# Altium schematic sheet HDMI.SchDoc
size A3; Organization: ICNS, MARCS Institute; Address1: Werrington South Campus, Great Western Highway; Address2: Werrington, NSW, 2747; SheetNumber: 14; SheetTotal: 16
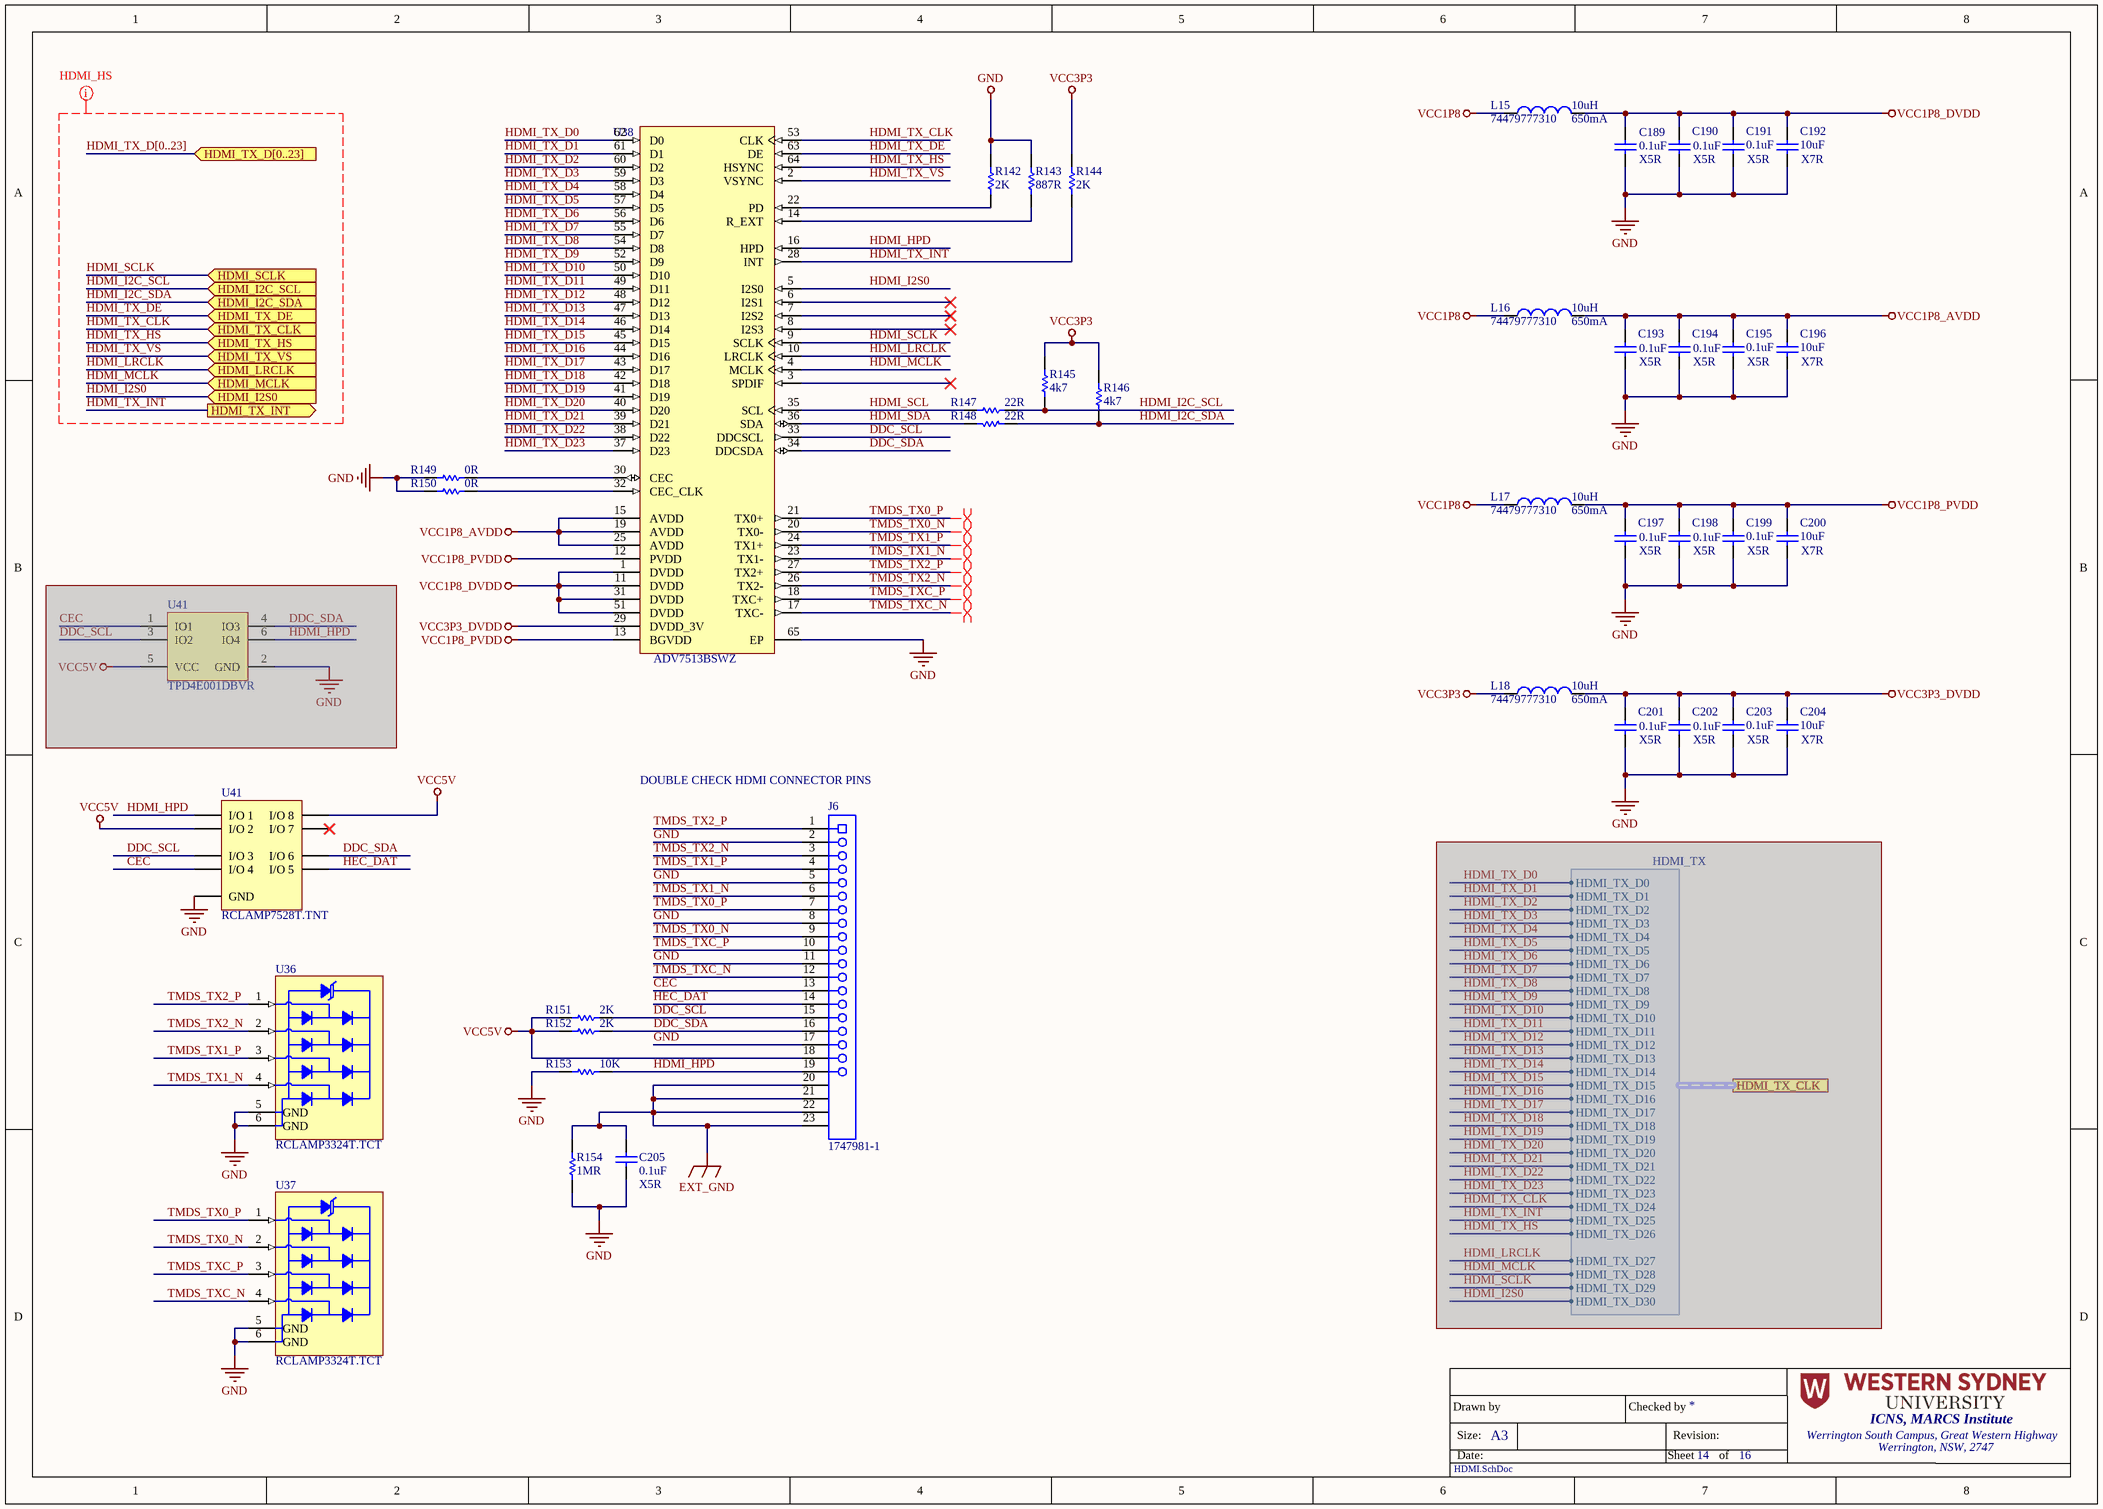
[diagram p0: HDMI.SchDoc]

## Parts
(Parts that share a designator on the sheet are numbered #1, #2 ... from top to bottom, then left to right.)
C189  value 0.1uF  Dielectric: X5R  [CAP 0201 (0603)]  (hidden comment: CL03A104KP3NNNC)
C190  value 0.1uF  Dielectric: X5R  [CAP 0201 (0603)]  (hidden comment: CL03A104KP3NNNC)
C191  value 0.1uF  Dielectric: X5R  [CAP 0201 (0603)]  (hidden comment: CL03A104KP3NNNC)
C192  value 10uF  Dielectric: X7R  [CAP 0805 (2012)]  (hidden comment: GCM21BR71A106KE22K)
C193  value 0.1uF  Dielectric: X5R  [CAP 0201 (0603)]  (hidden comment: CL03A104KP3NNNC)
C194  value 0.1uF  Dielectric: X5R  [CAP 0201 (0603)]  (hidden comment: CL03A104KP3NNNC)
C195  value 0.1uF  Dielectric: X5R  [CAP 0201 (0603)]  (hidden comment: CL03A104KP3NNNC)
C196  value 10uF  Dielectric: X7R  [CAP 0805 (2012)]  (hidden comment: GCM21BR71A106KE22K)
C197  value 0.1uF  Dielectric: X5R  [CAP 0201 (0603)]  (hidden comment: CL03A104KP3NNNC)
C198  value 0.1uF  Dielectric: X5R  [CAP 0201 (0603)]  (hidden comment: CL03A104KP3NNNC)
C199  value 0.1uF  Dielectric: X5R  [CAP 0201 (0603)]  (hidden comment: CL03A104KP3NNNC)
C200  value 10uF  Dielectric: X7R  [CAP 0805 (2012)]  (hidden comment: GCM21BR71A106KE22K)
C201  value 0.1uF  Dielectric: X5R  [CAP 0201 (0603)]  (hidden comment: CL03A104KP3NNNC)
C202  value 0.1uF  Dielectric: X5R  [CAP 0201 (0603)]  (hidden comment: CL03A104KP3NNNC)
C203  value 0.1uF  Dielectric: X5R  [CAP 0201 (0603)]  (hidden comment: CL03A104KP3NNNC)
C204  value 10uF  Dielectric: X7R  [CAP 0805 (2012)]  (hidden comment: GCM21BR71A106KE22K)
C205  value 0.1uF  Dielectric: X5R  [CAP 0201 (0603)]  (hidden comment: CL03A104KP3NNNC)
J6  1747981-1  [TE-1747981-1_V]
L15  74479777310  value 10uH  Current Rating: 650mA  [INDC2012X15N]
L16  74479777310  value 10uH  Current Rating: 650mA  [INDC2012X15N]
L17  74479777310  value 10uH  Current Rating: 650mA  [INDC2012X15N]
L18  74479777310  value 10uH  Current Rating: 650mA  [INDC2012X15N]
R142  value 2K  [RES 0201 (0603)]  (hidden comment: CRCW02012K00FKED)
R143  value 887R  [RES 0402 (1005)]  (hidden comment: RK73H1ETTP8870F)
R144  value 2K  [RES 0201 (0603)]  (hidden comment: CRCW02012K00FKED)
R145  value 4k7  [RES 0201 (0603)]  (hidden comment: AC0201FR-074K7L)
R146  value 4k7  [RES 0201 (0603)]  (hidden comment: AC0201FR-074K7L)
R147  value 22R  [RES 0201 (0603)]  (hidden comment: AC0201FR-0722RL)
R148  value 22R  [RES 0201 (0603)]  (hidden comment: AC0201FR-0722RL)
R149  value 0R  [RES 0201 (0603)]  (hidden comment: AF0201JR-070RL)
R150  value 0R  [RES 0201 (0603)]  (hidden comment: AF0201JR-070RL)
R151  value 2K  [RES 0201 (0603)]  (hidden comment: CRCW02012K00FKED)
R152  value 2K  [RES 0201 (0603)]  (hidden comment: CRCW02012K00FKED)
R153  value 10K  [RES 0201 (0603)]  (hidden comment: AC0201FR-0710KL)
R154  value 1MR  [RES 0201 (0603)]  (hidden comment: ERJ-1GNF1004C)
U36  RCLAMP3324T.TCT  [DIO_RCLAMP3324T.TCT]
U37  RCLAMP3324T.TCT  [DIO_RCLAMP3324T.TCT]
U38  ADV7513BSWZ  [ADI-LQFP-64_L]
U41#1  TPD4E001DBVR  [DBV0006A_L]  (masked out: inside a compile mask, not in the netlist)
U41#2  RCLAMP7528T.TNT  [DIO_RCLAMP7528T.TNT]

## Ports
HDMI_I2C_SCL (in), HDMI_I2C_SDA (in), HDMI_I2S0 (in), HDMI_LRCLK (in), HDMI_MCLK (in), HDMI_SCLK (in), HDMI_TX_CLK (harness HDMI_TX), HDMI_TX_CLK (in), HDMI_TX_D[0..23] (in), HDMI_TX_DE (in), HDMI_TX_HS (in), HDMI_TX_INT (out), HDMI_TX_VS (in)

## Harnesses
HDMI_TX: HDMI_TX_D0, HDMI_TX_D1, HDMI_TX_D2, HDMI_TX_D3, HDMI_TX_D4, HDMI_TX_D5, HDMI_TX_D6, HDMI_TX_D7, HDMI_TX_D8, HDMI_TX_D9, HDMI_TX_D10, HDMI_TX_D11, HDMI_TX_D12, HDMI_TX_D13, HDMI_TX_D14, HDMI_TX_D15, HDMI_TX_D16, HDMI_TX_D17, HDMI_TX_D18, HDMI_TX_D19, HDMI_TX_D20, HDMI_TX_D21, HDMI_TX_D22, HDMI_TX_D23, HDMI_TX_D24, HDMI_TX_D25, HDMI_TX_D26, HDMI_TX_D27, HDMI_TX_D28, HDMI_TX_D29, HDMI_TX_D30

## Nets
EXT_GND: C205.2 J6.20(SHLD1) J6.21(SHLD2) J6.22(SHLD3) J6.23(SHLD4) R154.2
GND: C189.2 C190.2 C191.2 C192.2 C193.2 C194.2 C195.2 C196.2 C197.2 C198.2 C199.2 C200.2 C201.2 C202.2 C203.2 C204.2 C205.1 J6.2 J6.5 J6.8 J6.11 J6.17 R142.1 R143.1 R149.2 R150.2 R153.1 R154.1 U36.5(GND) U36.6(GND) U37.5(GND) U37.6(GND) U38.65(EP) U41#2.3(GND)
VCC1P8: L15.1 L16.1 L17.1
VCC1P8_AVDD: C193.1 C194.1 C195.1 C196.1 L16.2 U38.15(AVDD) U38.19(AVDD) U38.25(AVDD)
VCC1P8_DVDD: C189.1 C190.1 C191.1 C192.1 L15.2 U38.1(DVDD) U38.11(DVDD) U38.31(DVDD) U38.51(DVDD)
VCC1P8_PVDD: C197.1 C198.1 C199.1 C200.1 L17.2 U38.12(PVDD) U38.13(BGVDD)
VCC3P3: L18.1 R144.1 R145.2 R146.2
VCC3P3_DVDD: C201.1 C202.1 C203.1 C204.1 L18.2 U38.29(DVDD_3V)
VCC5V: J6.18 R151.1 R152.1 U41#2.2(I/O_2) U41#2.9(I/O_8)
CEC: J6.13 U41#2.5(I/O_4)
DDC_SCL: J6.15 R151.2 U38.33(DDCSCL) U41#2.4(I/O_3)
DDC_SDA: J6.16 R152.2 U38.34(DDCSDA) U41#2.7(I/O_6)
HDMI_HPD: J6.19 R153.2 U38.16(HPD) U41#2.1(I/O_1)
HDMI_I2C_SCL: R145.1 R147.1 ; port HDMI_I2C_SCL
HDMI_I2C_SDA: R146.1 R148.2 ; port HDMI_I2C_SDA
HDMI_I2S0: U38.5(I2S0) ; port HDMI_I2S0
HDMI_LRCLK: U38.10(LRCLK) ; port HDMI_LRCLK
HDMI_MCLK: U38.4(MCLK) ; port HDMI_MCLK
HDMI_SCL: R147.2 U38.35(SCL)
HDMI_SCLK: U38.9(SCLK) ; port HDMI_SCLK
HDMI_SDA: R148.1 U38.36(SDA)
HDMI_TX_CLK: U38.53(CLK) ; port HDMI_TX_CLK
HDMI_TX_D0: U38.62(D0)
HDMI_TX_D1: U38.61(D1)
HDMI_TX_D2: U38.60(D2)
HDMI_TX_D3: U38.59(D3)
HDMI_TX_D4: U38.58(D4)
HDMI_TX_D5: U38.57(D5)
HDMI_TX_D6: U38.56(D6)
HDMI_TX_D7: U38.55(D7)
HDMI_TX_D8: U38.54(D8)
HDMI_TX_D9: U38.52(D9)
HDMI_TX_D10: U38.50(D10)
HDMI_TX_D11: U38.49(D11)
HDMI_TX_D12: U38.48(D12)
HDMI_TX_D13: U38.47(D13)
HDMI_TX_D14: U38.46(D14)
HDMI_TX_D15: U38.45(D15)
HDMI_TX_D16: U38.44(D16)
HDMI_TX_D17: U38.43(D17)
HDMI_TX_D18: U38.42(D18)
HDMI_TX_D19: U38.41(D19)
HDMI_TX_D20: U38.40(D20)
HDMI_TX_D21: U38.39(D21)
HDMI_TX_D22: U38.38(D22)
HDMI_TX_D23: U38.37(D23)
HDMI_TX_DE: U38.63(DE) ; port HDMI_TX_DE
HDMI_TX_HS: U38.64(HSYNC) ; port HDMI_TX_HS
HDMI_TX_INT: R144.2 U38.28(INT) ; port HDMI_TX_INT
HDMI_TX_VS: U38.2(VSYNC) ; port HDMI_TX_VS
HEC_DAT: J6.14 U41#2.6(I/O_5)
TMDS_TX0_N: J6.9 U37.2(In_2) U38.20(TX0-)
TMDS_TX0_P: J6.7 U37.1(In_1) U38.21(TX0+)
TMDS_TX1_N: J6.6 U36.4(In_4) U38.23(TX1-)
TMDS_TX1_P: J6.4 U36.3(In_3) U38.24(TX1+)
TMDS_TX2_N: J6.3 U36.2(In_2) U38.26(TX2-)
TMDS_TX2_P: J6.1 U36.1(In_1) U38.27(TX2+)
TMDS_TXC_N: J6.12 U37.4(In_4) U38.17(TXC-)
TMDS_TXC_P: J6.10 U37.3(In_3) U38.18(TXC+)
NetR142_2: R142.2 U38.22(PD)
NetR143_2: R143.2 U38.14(R_EXT)
NetR149_1: R149.1 U38.30(CEC)
NetR150_1: R150.1 U38.32(CEC_CLK)

Not connected (* = marked no-connect by the designer): U38 3(SPDIF)* 6(I2S1)* 7(I2S2)* 8(I2S3)*; U41#2 8(I/O_7)*

## Buses and harness runs
bus HDMI_TX_D[0..23] = port HDMI_TX_D[0..23]

## Layout directives
differential pair; differential pair class TMDS_TX0; net class DIGITAL: TMDS_TX0_N, TMDS_TX0_P
differential pair; net class DIGITAL; differential pair class TMDS_TX1: TMDS_TX1_N, TMDS_TX1_P
differential pair; net class DIGITAL; differential pair class TMDS_TX2: TMDS_TX2_N, TMDS_TX2_P
differential pair; net class DIGITAL; differential pair class TMDS_TXC: TMDS_TXC_N, TMDS_TXC_P
net class HDMI: HDMI_I2C_SCL, HDMI_I2C_SDA, HDMI_I2S0, HDMI_LRCLK, HDMI_MCLK, HDMI_SCLK, HDMI_TX_CLK, HDMI_TX_D[0..23], HDMI_TX_DE, HDMI_TX_HS, HDMI_TX_INT, HDMI_TX_VS

## Notes on the sheet
- (near J6) DOUBLE CHECK HDMI CONNECTOR PINS
- Drawn by
- Size:
- Date:
- A3
- Checked by
- Sheet
- Revision:
- of

## Library data of the parts
C189-C191 C193-C195 C197-C199 C201-C203 C205 = CMP-003-000014-1: Cap Ceramic 0.1uF 10V X5R 10% Pad SMD 0201 85C T/R; Manufacturer: Samsung; Capacitance: 100nF; Stock 1: 12175; Pricing 1: 1=0.10000, 10=0.02900, 50=0.01600, 100=0.01300, 500=0.00932, 1000=0.00732, 2500=0.00666, 5000=0.00612 (USD); RoHS: Yes; Mount: Surface Mount; Case/Package: 0201; Case Code (Metric): 0603; Case Code (Imperial): 0201; Contact Plating: Tin; Min Operating Temperature: -55°C; Max Operating Temperature: 85°C; Tolerance: 10%; Packaging: Tape and Reel; Package Quantity: 1; Voltage Rating: 10V; Length: 0.6mm; Height: 0.3mm; Width: 0.012inch; Thickness: 0.013inch; Depth: 0.3mm; Radiation Hardening: No; ComponentLink1URL: https://datasheet.ciiva.com/25803/cl03a104kp3nnnc-25803204.pdf?src-supplier=Digi-Key; ComponentLink1Description: https://datasheet.ciiva.com/25803/cl03a104kp3nnnc-25803204.pdf?src-supplier=Digi-Key; ComponentLink2URL: https://datasheet.ciiva.com/26838/getdatasheetpartid-357484-26838083.pdf?src-supplier=Verical; ComponentLink2Description: https://datasheet.ciiva.com/26838/getdatasheetpartid-357484-26838083.pdf?src-supplier=Verical; Source: ICNS_PropheseeLib.SchLib; Manufacturer Part Number: CL03A104KP3NNNC; Lead Free: Lead Free; Series: CL; Design Item ID: CL03A104KP3NNNC; Voltage Rating (DC): 10V; Category: Ceramic Capacitors; Construction: Flat
C192 C196 C200 C204 = CMP-003-000011-1: 0805 10 uF 10 V ±10 % Tolerance X7R Surface Mount Multilayer Ceramic Capacitor; Manufacturer: Murata; Tolerance: 10%; Voltage Rating: 10V; RoHS: Yes; Mount: Surface Mount; Case/Package: 0805; Case Code (Metric): 2012; Case Code (Imperial): 0805; Min Operating Temperature: -55°C; Max Operating Temperature: 125°C; Packaging: Tape and Reel; Package Quantity: 10000; Capacitance: 10uF; Length: 0.079inch; Height: 1.25mm; Width: 1.25mm; Thickness: 0.055inch; ComponentLink1URL: http://www.mouser.com/ds/2/281/c03e-806517.pdf?src-supplier=Mouser; ComponentLink1Description: http://www.mouser.com/ds/2/281/c03e-806517.pdf?src-supplier=Mouser; ComponentLink2URL: https://search.murata.co.jp/Ceramy/image/img/A01X/G101/ENG/GCM21BR71A106KE22-01.pdf?src-supplier=Digi-Key; ComponentLink2Description: https://search.murata.co.jp/Ceramy/image/img/A01X/G101/ENG/GCM21BR71A106KE22-01.pdf?src-supplier=Digi-Key; Category: Ceramic Capacitors; Design Item ID: GCM21BR71A106KE22K; Voltage Rating (DC): 10V; Ratings: AEC-Q200; ComponentLink3URL: http://search.murata.co.jp/Ceramy/image/img/A01X/partnumbering_e_02.pdf?src-supplier=Digi-Key; Weight: 0.000335oz; ComponentLink4Description: http://search.murata.co.jp/Ceramy/image/img/A01X/G101/ENG/GCM21BR71A106KE22-01.pdf?src-supplier=Digi-Key; RoHS Compliant: Yes; Manufacturer Part Number: GCM21BR71A106KE22K; Source: ICNS_PropheseeLib.SchLib; Pricing: 1=0.45000, 10=0.31600, 50=0.23880, 100=0.20790, 500=0.15400, 1000=0.13090, 2500=0.12320, 5000=0.11550 (USD); Stock: 4655; ComponentLink4URL: http://search.murata.co.jp/Ceramy/image/img/A01X/G101/ENG/GCM21BR71A106KE22-01.pdf?src-supplier=Digi-Key; Termination: SMD/SMT; ComponentLink3Description: http://search.murata.co.jp/Ceramy/image/img/A01X/partnumbering_e_02.pdf?src-supplier=Digi-Key
J6 = CMP-010-000002-2: HDMI Connector, Jack, 19, Pcb Mount, Metal Body, Gold Plated Contacts Rohs Compliant: Yes; Manufacturer Part Number: 17479811; Manufacturer: TE Connectivity; Voltage Rating: 40V; Circuit Application: Signal; Number of Contacts: 19; Plating: Matte,Tin; Connector System: Cable-to-Board; Plating Thickness: 0.1um; Number of Ports: 1; Current Rating: 500mA; Gender: Female; Pitch: 1mm; Mating Cycles: 10000; Connector Type: Receptacle; Packaging: Tape and Reel; Max Operating Temperature: 70°C; Case/Package: Metal; Mount: Surface Mount; ComponentLink2URL: https://datasheet.ciiva.com/851/eng-cd-1747981-f4-1747981-c-f4-851091.pdf?src-supplier=Digi-Key; Length: 15mm; ComponentLink2Description: https://datasheet.ciiva.com/851/eng-cd-1747981-f4-1747981-c-f4-851091.pdf?src-supplier=Digi-Key; ComponentLink1Description: https://datasheet.ciiva.com/16499/1747981-1-16499903.pdf?src-supplier=Future+Electronics; Package Quantity: 300; Min Operating Temperature: -25°C; ComponentLink1URL: https://datasheet.ciiva.com/16499/1747981-1-16499903.pdf?src-supplier=Future+Electronics; REACH SVHC: No SVHC; ComponentLink7URL: https://datasheet.ciiva.com/14118/04229001-14118203.pdf?src-supplier=Distrelec; Preloaded: Yes; Contact Material: Copper Alloy; Source: ICNS_PropheseeLib.SchLib; ComponentLink7Description: https://datasheet.ciiva.com/14118/04229001-14118203.pdf?src-supplier=Distrelec; ComponentLink5Description: https://datasheet.ciiva.com/3094/eng-ds-6-1773453-4-hdmi-qrg-1208-3094821.pdf?src-supplier=Avnet; Insulation Color: Black; Design Item ID: 1747981-1; ComponentLink9URL: https://datasheet.ciiva.com/1095/eng-ds-1773083-1-connectors-and-cable-assembl-0808-1095062.pdf?src-supplier=Element14; ComponentLink8Description: https://datasheet.ciiva.com/30218/ddecontrolleractionsrchrtrvdocnm617734534-hdmi-qrgdoctype-30218167.pdf?src-supplier=Onlinecomponents.com; RoHS: Yes; Lead Free: Lead Free; ComponentLink5URL: https://datasheet.ciiva.com/3094/eng-ds-6-1773453-4-hdmi-qrg-1208-3094821.pdf?src-supplier=Avnet; Termination: SMD/SMT; Flammability Rating: UL94 V-0; Orientation: Right Angle; Number of Positions: 19; Body Material: Metal; Category: Modular / Ethernet Connectors; ComponentLink8URL: https://datasheet.ciiva.com/30218/ddecontrolleractionsrchrtrvdocnm617734534-hdmi-qrgdoctype-30218167.pdf?src-supplier=Onlinecomponents.com; ComponentLink3Description: https://datasheet.ciiva.com/851/eng-cd-1747981-f4-1747981-c-f4-851092.pdf?src-supplier=Digi-Key; Housing Color: Black; ComponentLink4URL: https://datasheet.ciiva.com/851/eng-cd-1747981-f4-1747981-c-f4-851093.pdf?src-supplier=Digi-Key; ComponentLink6URL: https://datasheet.ciiva.com/16545/eng-ds-6-1773453-4-hdmi-qrg-1208-16545819.pdf?src-supplier=Avnet+Europe; ELV: Compliant; Contact Plating: Gold; ComponentLink6Description: https://datasheet.ciiva.com/16545/eng-ds-6-1773453-4-hdmi-qrg-1208-16545819.pdf?src-supplier=Avnet+Europe; ComponentLink4Description: https://datasheet.ciiva.com/851/eng-cd-1747981-f4-1747981-c-f4-851093.pdf?src-supplier=Digi-Key; Depth: 11.55mm; ComponentLink9Description: https://datasheet.ciiva.com/1095/eng-ds-1773083-1-connectors-and-cable-assembl-0808-1095062.pdf?src-supplier=Element14; Contact Current Rating: 500mA; Housing Material: Thermoplastic; Series: -; ComponentLink3URL: https://datasheet.ciiva.com/851/eng-cd-1747981-f4-1747981-c-f4-851092.pdf?src-supplier=Digi-Key; Number of Terminals/Pins: 19; Color: Silver,Black
L15-L18 = CMP-005-000002-1: Inductor WE-PMI Series 10 µH; Multilayer SMD ; 0805 Case; 25MHz Q: 35 650mA 500mO; Manufacturer: Wurth Electronics; Inductance Tolerance: 20%; Core Material: Nickel Zinc Ferrite (NiZn); Test Frequency: 1MHz; DC Resistance (DCR): 625mR; Saturation Rating: 125mA; ComponentLink2URL: http://www.farnell.com/datasheets/2618711.pdf?src-supplier=Newark; ComponentLink2Description: http://www.farnell.com/datasheets/2618711.pdf?src-supplier=Newark; ComponentLink1Description: http://www.farnell.com/datasheets/2618711.pdf?src-supplier=Farnell; Inductance: 10uH; ComponentLink1URL: http://www.farnell.com/datasheets/2618711.pdf?src-supplier=Farnell; Design Item ID: 74479777310; Stock 1: 800; Category: Fixed Inductors; Manufacturer Part Number: 74479777310; RoHS Compliant: Yes; RoHS: Yes; Source: ICNS_PropheseeLib.SchLib; Case/Package: SMD/SMT; Pricing 1: 10=1.37800, 500=0.87800 (USD)
R142 R144 R151 R152 = CMP-006-000024-1: Res Thick Film 0201 2K Ohm 1% 1/20W ±100ppm/°C Molded SMD SMD Paper T/R; Manufacturer: Vishay Dale; Max Power Dissipation: 50mW; Resistance: 2kR; Voltage Rating: 30V; RoHS: Yes; Case/Package: 0201; Case Code (Metric): 0603; Case Code (Imperial): 0201; Min Operating Temperature: -55°C; Max Operating Temperature: 155°C; Tolerance: 1%; Number of Terminations: 2; Temperature Coefficient: 100ppm/°C; Width: 0.3mm; ComponentLink1URL: https://datasheet.ciiva.com/3255/crcw0201e3-3255934.pdf?src-supplier=Avnet; ComponentLink1Description: https://datasheet.ciiva.com/3255/crcw0201e3-3255934.pdf?src-supplier=Avnet; Stock 1: 17990; Pricing 1: 1=0.28000, 10=0.24000, 100=0.09400, 1000=0.03933, 2500=0.03605, 5000=0.03278 (USD); Contact Plating: Tin; Military Standard: Not; Termination: SMD/SMT; Power Rating: 50mW; Packaging: Tape and Reel; Length: 0.6mm; Height: 0.23mm; Depth: 0.3mm; Lead Free: Lead Free; Source: ICNS_PropheseeLib.SchLib; Series: CRCW; Category: Chip SMD Resistors; Radiation Hardening: No; Resistor Type: Thick Film; Design Item ID: CRCW02012K00FKED; Construction: Rectangular; RoHS Compliant: Yes; Manufacturer Part Number: CRCW02012K00FKED; Voltage Rating (DC): 30V; Weight: 6E-06oz
R143 = CMP-006-000044-2: Res Thick Film 0402 887 Ohm 1% 0.1W(1/10W) ±100ppm/C Pad SMD Automotive T/R; Manufacturer: KOA Speer; Manufacturer Series: RK73H; Temperature Coefficient: 100ppm/°C; Power Rating: 100mW; Voltage Rating (DC): 50V; Additional Feature: PRECISION; RoHS: Yes; Case/Package: 0402; Case Code (Metric): 1005; Case Code (Imperial): 0402; Min Operating Temperature: -55°C; Max Operating Temperature: 155°C; Tolerance: 1%; Width: 0.5mm; ComponentLink1URL: http://www.mouser.com/ds/2/219/RK73H-5715.pdf?src-supplier=Mouser; ComponentLink1Description: http://www.mouser.com/ds/2/219/RK73H-5715.pdf?src-supplier=Mouser; ComponentLink2URL: http://components.arrow.com/part/dataview/39721137S7611196N5146?src-supplier=Arrow+Electronics; ComponentLink2Description: http://components.arrow.com/part/dataview/39721137S7611196N5146?src-supplier=Arrow+Electronics; ComponentLink3URL: http://www.jameco.com/Jameco/Products/ProdDS/1884274.pdf?src-supplier=Jameco; ComponentLink3Description: http://www.jameco.com/Jameco/Products/ProdDS/1884274.pdf?src-supplier=Jameco; Stock 1: 87; Pricing 1: 1=0.10000, 10=0.03000, 100=0.01220, 1000=0.00549, 2500=0.00476, 5000=0.00393 (USD); Military Standard: Not; Termination: SMD/SMT; Package Quantity: 10000; Resistance: 887R; Packaging: Tape and Reel; Length: 1mm; Height: 0.35mm; Depth: 0.5mm; Lead Free: Lead Free; Design Item ID: RK73H1ETTP8870F; Size Code: 0402; Construction: Rectangular; Package Shape: Rectangular; Series: RK73H; Technology: METAL GLAZE/THICK FILM; Category: Chip SMD Resistors; Resistor Type: Thick Film; Manufacturer Part Number: RK73H1ETTP8870F; Terminal Finish: Tin; Source: ICNS_PropheseeLib.SchLib; Working Voltage: 50V; RoHS Compliant: Yes; Voltage Rating: 50V
R145 R146 = CMP-006-000022-1: Res Thick Film 0201 4.7K Ohm 1% 1/20W ±200ppm/°C Molded SMD Paper T/R; Manufacturer: Yageo; Max Power Dissipation: 50mW; Resistance: 4.7kR; RoHS: Yes; Case/Package: 0201; Case Code (Metric): 0603; Case Code (Imperial): 0201; Min Operating Temperature: -55°C; Max Operating Temperature: 155°C; Tolerance: 1%; Number of Terminations: 2; Temperature Coefficient: 200ppm/°C; Width: 0.012inch; ComponentLink1URL: http://www.yageo.com/NewPortal/yageodocoutput?fileName=/pdf/R-Chip/PYu-AC_51_RoHS_L_6.pdf&src-supplier=Digi-Key; ComponentLink1Description: http://www.yageo.com/NewPortal/yageodocoutput?fileName=/pdf/R-Chip/PYu-AC_51_RoHS_L_6.pdf&src-supplier=Digi-Key; Stock 1: 267560; Pricing 1: 1=0.10000, 10=0.06600, 100=0.02670, 1000=0.01201, 2500=0.01042, 5000=0.00861 (USD); Features: Moisture Resistant,Automotive AEC-Q200; Packaging: Tape and Reel; Length: 0.024inch; Height: 0.01inch; Lead Free: Lead Free; Source: ICNS_PropheseeLib.SchLib; Manufacturer Part Number: AC0201FR-074K7L; Design Item ID: AC0201FR-074K7L; Category: Chip SMD Resistors; Resistor Type: Thick Film
R147 R148 = CMP-006-000052-2: Res Thick Film 0201 22 Ohm 1% 0.05W(1/20W) ±200ppm/C Pad SMD Automotive T/R; Manufacturer: Yageo; Max Power Dissipation: 50mW; Temperature Coefficient: 200ppm/°C; Power Rating: 100mW; Voltage Rating (DC): 50V; RoHS: Yes; Case/Package: 0201; Case Code (Metric): 0603; Case Code (Imperial): 0201; Min Operating Temperature: -55°C; Max Operating Temperature: 155°C; Tolerance: 1%; Number of Terminations: 2; Width: 0.012inch; ComponentLink1URL: https://datasheet.ciiva.com/11819/0900766b80f96399-11819285.pdf?src-supplier=RSComponents; ComponentLink1Description: https://datasheet.ciiva.com/11819/0900766b80f96399-11819285.pdf?src-supplier=RSComponents; ComponentLink2URL: https://datasheet.ciiva.com/2454/pyu-r-int-thick-7-2454354.pdf?src-supplier=Digi-Key; ComponentLink2Description: https://datasheet.ciiva.com/2454/pyu-r-int-thick-7-2454354.pdf?src-supplier=Digi-Key; ComponentLink3URL: https://datasheet.ciiva.com/2454/pyu-r-int-thick-7-2454355.pdf?src-supplier=Digi-Key; ComponentLink3Description: https://datasheet.ciiva.com/2454/pyu-r-int-thick-7-2454355.pdf?src-supplier=Digi-Key; Stock 1: 375294; Pricing 1: 5000=0.00312 (USD); Features: Moisture Resistant,Automotive AEC-Q200; Military Standard: Not; Termination: SMD/SMT; Package Quantity: 1; Resistance: 22R; Packaging: Cut Tape; Length: 0.024inch; Height: 0.01inch; Depth: 0.8mm; Lead Free: Lead Free; ComponentLink4URL: https://datasheet.ciiva.com/2454/pyu-r-int-thick-7-2454356.pdf?src-supplier=Digi-Key; ComponentLink4Description: https://datasheet.ciiva.com/2454/pyu-r-int-thick-7-2454356.pdf?src-supplier=Digi-Key; Series: AC; ComponentLink6URL: https://datasheet.ciiva.com/46440/1868787-46440901.pdf?src-supplier=Element14; REACH SVHC: No SVHC; ComponentLink5Description: https://datasheet.ciiva.com/46395/443971-46395032.pdf?src-supplier=Element14; Source: ICNS_PropheseeLib.SchLib; Technology: THICK FILM; ComponentLink5URL: https://datasheet.ciiva.com/46395/443971-46395032.pdf?src-supplier=Element14; Resistor Type: Thick Film; Voltage Rating: 50V; Size Code: 0603; ComponentLink6Description: https://datasheet.ciiva.com/46440/1868787-46440901.pdf?src-supplier=Element14; RoHS Compliant: Yes; Number of Pins: 2; Resistance Tolerance: 1%; Category: Chip SMD Resistors; Construction: Rectangular
R149 R150 = CMP-006-000020-1: Res Thick Film 0201 0 Ohm Sulfur Resistant Pad SMD Automotive T/R; Manufacturer: Yageo; Max Power Dissipation: 50mW; Resistance: 0mR; RoHS: Yes; Case/Package: 0201; Case Code (Metric): 0603; Case Code (Imperial): 0201; Min Operating Temperature: -55°C; Max Operating Temperature: 125°C; Number of Terminations: 2; Width: 0.012inch; ComponentLink1URL: http://www.mouser.com/ds/2/447/PYu-AF_51_RoHS_L_5-1085711.pdf?src-supplier=Mouser; ComponentLink1Description: http://www.mouser.com/ds/2/447/PYu-AF_51_RoHS_L_5-1085711.pdf?src-supplier=Mouser; ComponentLink2URL: http://www.yageo.com/documents/recent/PYu-AF_51_RoHS_L_5.pdf?src-supplier=Digi-Key; ComponentLink2Description: http://www.yageo.com/documents/recent/PYu-AF_51_RoHS_L_5.pdf?src-supplier=Digi-Key; Stock 1: 50009; Pricing 1: 1=0.11000, 10=0.09500, 25=0.06560, 50=0.05100, 100=0.03640, 250=0.02840, 500=0.02256, 1000=0.01602, 5000=0.01238 (USD); Features: Moisture Resistant,Anti-Sulfur; Termination: SMD/SMT; Package Quantity: 10000; Packaging: Tape and Reel; Length: 0.024inch; Height: 0.01inch; Design Item ID: AF0201JR-070RL; Weight: 6E-06oz; RoHS Compliant: Yes; Resistor Type: Thick Film; Source: ICNS_PropheseeLib.SchLib; Manufacturer Part Number: AF0201JR-070RL; Category: Chip SMD Resistors
R153 = CMP-006-000021-1: Res Thick Film 0201 10K Ohm 1% 0.05W(1/20W) ±200ppm/C Pad SMD Automotive T/R; Manufacturer: Yageo; Max Power Dissipation: 50mW; Temperature Coefficient: 200ppm/°C; Resistance: 10kR; RoHS: Yes; Case/Package: 0201; Case Code (Metric): 0603; Case Code (Imperial): 0201; Min Operating Temperature: -55°C; Max Operating Temperature: 155°C; Tolerance: 1%; Number of Terminations: 2; Width: 0.012inch; ComponentLink1URL: http://www.yageo.com/NewPortal/yageodocoutput?fileName=/pdf/R-Chip/PYu-AC_51_RoHS_L_6.pdf&src-supplier=Digi-Key; ComponentLink1Description: http://www.yageo.com/NewPortal/yageodocoutput?fileName=/pdf/R-Chip/PYu-AC_51_RoHS_L_6.pdf&src-supplier=Digi-Key; Stock 1: 698280; Pricing 1: 1=0.10000, 10=0.06600, 100=0.02670, 1000=0.01201, 2500=0.01042, 5000=0.00861 (USD); Features: Moisture Resistant,Automotive AEC-Q200; Packaging: Tape and Reel; Length: 0.024inch; Height: 0.01inch; Source: ICNS_PropheseeLib.SchLib; Manufacturer Part Number: AC0201FR-0710KL; Category: Chip SMD Resistors; Resistor Type: Thick Film; Design Item ID: AC0201FR-0710KL
R154 = CMP-006-000042-1: Res Thick Film 0201 1M Ohm 1% 0.05W(1/20W) ±200ppm/C Pad SMD Automotive T/R; Manufacturer: Panasonic; Max Power Dissipation: 50mW; Temperature Coefficient: 200ppm/°C; Working Voltage: 25V; RoHS: Yes; Mount: Surface Mount; Case/Package: 0201; Case Code (Metric): 0603; Case Code (Imperial): 0201; Min Operating Temperature: -55°C; Max Operating Temperature: 125°C; Tolerance: 1%; Number of Terminations: 2; Width: 0.3mm; ComponentLink1URL: https://datasheet.ciiva.com/43467/1678782-43467126.pdf?src-supplier=Farnell; ComponentLink1Description: https://datasheet.ciiva.com/43467/1678782-43467126.pdf?src-supplier=Farnell; ComponentLink2URL: https://datasheet.ciiva.com/46375/1678782-46375423.pdf?src-supplier=Element14; ComponentLink2Description: https://datasheet.ciiva.com/46375/1678782-46375423.pdf?src-supplier=Element14; ComponentLink3URL: https://datasheet.ciiva.com/22742/1678782-22742862.pdf?src-supplier=Element14; ComponentLink3Description: https://datasheet.ciiva.com/22742/1678782-22742862.pdf?src-supplier=Element14; Stock 1: 1665; Pricing 1: 1=0.10000, 10=0.06500, 100=0.02660, 1000=0.01192, 2500=0.01035, 5000=0.00855 (USD); Contact Plating: Tin,Matte; Package Quantity: 15000; Resistance: 1MR; Power Rating: 50mW; Packaging: Tape and Reel; Length: 0.6mm; Height: 0.01inch; Lead Free: Lead Free; ComponentLink4URL: https://datasheet.ciiva.com/22742/1678782-22742861.pdf?src-supplier=Element14; ComponentLink4Description: https://datasheet.ciiva.com/22742/1678782-22742861.pdf?src-supplier=Element14; Technology: THICK FILM; ComponentLink5URL: https://datasheet.ciiva.com/16201/aoa0000ce2-16201493.pdf?src-supplier=Future+Electronics; ComponentLink5Description: https://datasheet.ciiva.com/16201/aoa0000ce2-16201493.pdf?src-supplier=Future+Electronics; Resistor Type: Thick Film; Resistance Tolerance: 1%; Manufacturer Part Number: ERJ-1GNF1004C; Voltage Rating: 25V; Category: Chip SMD Resistors; Radiation Hardening: No; Voltage Rating (DC): 25V; Design Item ID: ERJ-1GNF1004C; REACH SVHC: No SVHC; Number of Pins: 2; Source: ICNS_PropheseeLib.SchLib; Series: ERJ
U36 U37 = CMP-024-000001-2: TVS DIODE 3.3VWM 10.5VC; Manufacturer: Semtech; Clamping Voltage: 10.5V; Peak Pulse Current: 5A; Reverse Standoff Voltage: 3.3V; Number of Bidirectional Channels: 4; Min Breakdown Voltage: 3.8V; Power Line Protection: Yes; Peak Pulse Power: 75W; Packaging: Cut Tape; RoHS: Yes; Design Item ID: RCLAMP3324T.TCT; Number of Pins: 6; RoHS Compliant: Yes; Manufacturer Part Number: RCLAMP3324T.TCT; Source: Falcon_Neuro.SchLib; Min Operating Temperature: -40°C; Stock 1: 58192; Max Operating Temperature: 125°C; Category: TVS Diodes; Mount: Surface Mount; Pricing 1: 1=0.99000, 10=0.87200, 50=0.87200, 100=0.66800, 500=0.52800, 1000=0.42300, 2500=0.38300, 5000=0.34800, 10000=0.33500 (USD); Number of Unidirectional Channels: 4; Lead Free: Lead Free; Series: RailClamp®
U38 = CMP-015-000002-1: Video ICs HDMI 1.4a Compatible HDMI Tx with CEC; Manufacturer: Analog Devices; Number of Channels: 8; Min Supply Voltage: 1.71V; Sampling Rate: 165MS/s; Number of Transmitters: 3; Max Supply Voltage: 1.9V; Series: -; RoHS: Yes; Packaging: Tray; Number of Pins: 64; Source: ICNS_PropheseeLib.SchLib; Case/Package: LQFP; Stock 1: 404; Design Item ID: ADV7513BSWZ; Category: Analog to Digital Converters (ADCs); Interface: HDMI; Mount: Surface Mount; Min Operating Temperature: -25°C; ComponentLink2URL: https://datasheet.ciiva.com/15120/getdatasheetpartid-570006-15120176.pdf?src-supplier=Verical; RoHS Compliant: Yes; REACH SVHC: No SVHC; ComponentLink1URL: https://datasheet.ciiva.com/24017/adv7513-246455-24017325.pdf?src-supplier=Mouser; Lead Free: Contains Lead; ComponentLink3URL: https://datasheet.ciiva.com/28366/1828696-28366136.pdf?src-supplier=Element14; Manufacturer Part Number: ADV7513BSWZ; ComponentLink1Description: https://datasheet.ciiva.com/24017/adv7513-246455-24017325.pdf?src-supplier=Mouser; Max Operating Temperature: 85°C; ComponentLink2Description: https://datasheet.ciiva.com/15120/getdatasheetpartid-570006-15120176.pdf?src-supplier=Verical; Pricing 1: 1=17.61200, 10=15.85600, 25=14.08700, 100=13.21500 (USD); Package Quantity: 1; Radiation Hardening: No; ComponentLink3Description: https://datasheet.ciiva.com/28366/1828696-28366136.pdf?src-supplier=Element14
U41#1 = CMP-004-000004-1: Quad 1.5-pF, 5.5-V, ±8-kV ESD protection diode with 1-nA max leakage & VCC pin for USB 2.0 6-SOT-23 -40 to 85; Manufacturer: Texas Instruments; Number of Channels: 4; Peak Pulse Current: 5.5A; Direction: Unidirectional; Clamping Voltage: 105.5V; Max Power Dissipation: 100W; Power Line Protection: Yes; Leakage Current: 1nA; Capacitance: 1.5pF; Test Current: 10mA; Working Voltage: 5.5V; Min Breakdown Voltage: 11V; Interface: LVDS,USB,Ethernet; ComponentLink3Description: https://datasheet.ciiva.com/353/tpd4e001-353173.pdf?src-supplier=Digi-Key; ComponentLink2Description: https://datasheet.ciiva.com/353/tpd4e001-353172.pdf?src-supplier=Digi-Key; ComponentLink1Description: https://datasheet.ciiva.com/46381/1887655-46381800.pdf?src-supplier=Element14; ComponentLink2URL: https://datasheet.ciiva.com/353/tpd4e001-353172.pdf?src-supplier=Digi-Key; ComponentLink3URL: https://datasheet.ciiva.com/353/tpd4e001-353173.pdf?src-supplier=Digi-Key; ComponentLink1URL: https://datasheet.ciiva.com/46381/1887655-46381800.pdf?src-supplier=Element14; Height: 1.3mm; Category: Interface ICs; ComponentLink6Description: https://datasheet.ciiva.com/22621/1887655-22621477.pdf?src-supplier=Element14; Packaging: Tape and Reel; Lead Free: Lead Free; ComponentLink4Description: https://datasheet.ciiva.com/353/tpd4e001-353174.pdf?src-supplier=Digi-Key; ComponentLink4URL: https://datasheet.ciiva.com/353/tpd4e001-353174.pdf?src-supplier=Digi-Key; Termination: SMD/SMT; Manufacturer Part Number: TPD4E001DBVR; Case/Package: SOT-23; Peak Pulse Power: 100W; Package Quantity: 3000; Number of Pins: 6; RoHS: Yes; ComponentLink6URL: https://datasheet.ciiva.com/22621/1887655-22621477.pdf?src-supplier=Element14; Design Item ID: TPD4E001DBVR; ComponentLink5Description: https://datasheet.ciiva.com/16476/tpd4e001-16476189.pdf?src-supplier=Avnet+Asia; RoHS Compliant: Yes; Pricing 1: 1=0.64000, 10=0.56000, 100=0.42910, 500=0.33920, 1000=0.28000 (USD); ComponentLink5URL: https://datasheet.ciiva.com/16476/tpd4e001-16476189.pdf?src-supplier=Avnet+Asia; Max Reverse Leakage Current: 1nA; Radiation Hardening: No; Min Operating Temperature: -40°C; Source: ICNS_PropheseeLib.SchLib; Breakdown Voltage: 5.5V; Depth: 1.6mm; Number of Bidirectional Channels: 4; ESD Protection: Yes; REACH SVHC: No SVHC; Width: 1.75mm; Length: 2.9mm; Max Operating Temperature: 85°C; Series: -; Reverse Standoff Voltage: 5.5V; Operating Supply Voltage: 5.5V
U41#2 = CMP-004-000011-2: ESD Suppressor Diode Diode Array Uni-Dir 5V 9-Pin SLP T/R / TVS DIODE 5VWM 15VC SLP2611N9T; Manufacturer: Semtech; Peak Pulse Power: 75W; Clamping Voltage: 15V; Peak Pulse Current: 5A; Number of Bidirectional Channels: 8; Min Breakdown Voltage: 6.5V; Power Line Protection: Yes; ComponentLink1Description: http://www.mouser.com/ds/2/761/rclamp7528t-766746.pdf?src-supplier=Mouser; Pricing 1: 1=0.42300, 10=0.42300, 100=0.42300, 500=0.42300, 1000=0.42300, 2500=0.42300 (USD); ComponentLink4Description: https://www.verical.com/server-webapp/html/getDatasheet?partID=627013&src-supplier=Verical; ComponentLink1URL: http://www.mouser.com/ds/2/761/rclamp7528t-766746.pdf?src-supplier=Mouser; Stock 1: 9764; Lead Free: Lead Free; Source: ICNS_PropheseeLib.SchLib; ComponentLink3URL: http://www.semtech.com/images/datasheet/rclamp7528t.pdf?src-supplier=Digi-Key; Number of Pins: 9; Packaging: Tape and Reel; Manufacturer Part Number: RCLAMP7528T.TNT; Reverse Standoff Voltage: 5V; Design Item ID: RCLAMP7528T.TNT; ComponentLink3Description: http://www.semtech.com/images/datasheet/rclamp7528t.pdf?src-supplier=Digi-Key; Mount: Surface Mount; ComponentLink2Description: https://media.digikey.com/pdf/Data%20Sheets/Semtech%20PDFs/RCLAMP7528T.pdf?src-supplier=Digi-Key; Max Operating Temperature: 125°C; ComponentLink4URL: https://www.verical.com/server-webapp/html/getDatasheet?partID=627013&src-supplier=Verical; RoHS: Yes; Min Operating Temperature: -55°C; Category: TVS Diodes; ComponentLink2URL: https://media.digikey.com/pdf/Data%20Sheets/Semtech%20PDFs/RCLAMP7528T.pdf?src-supplier=Digi-Key